# Altium schematic sheet 16ASIC.SchDoc
size A
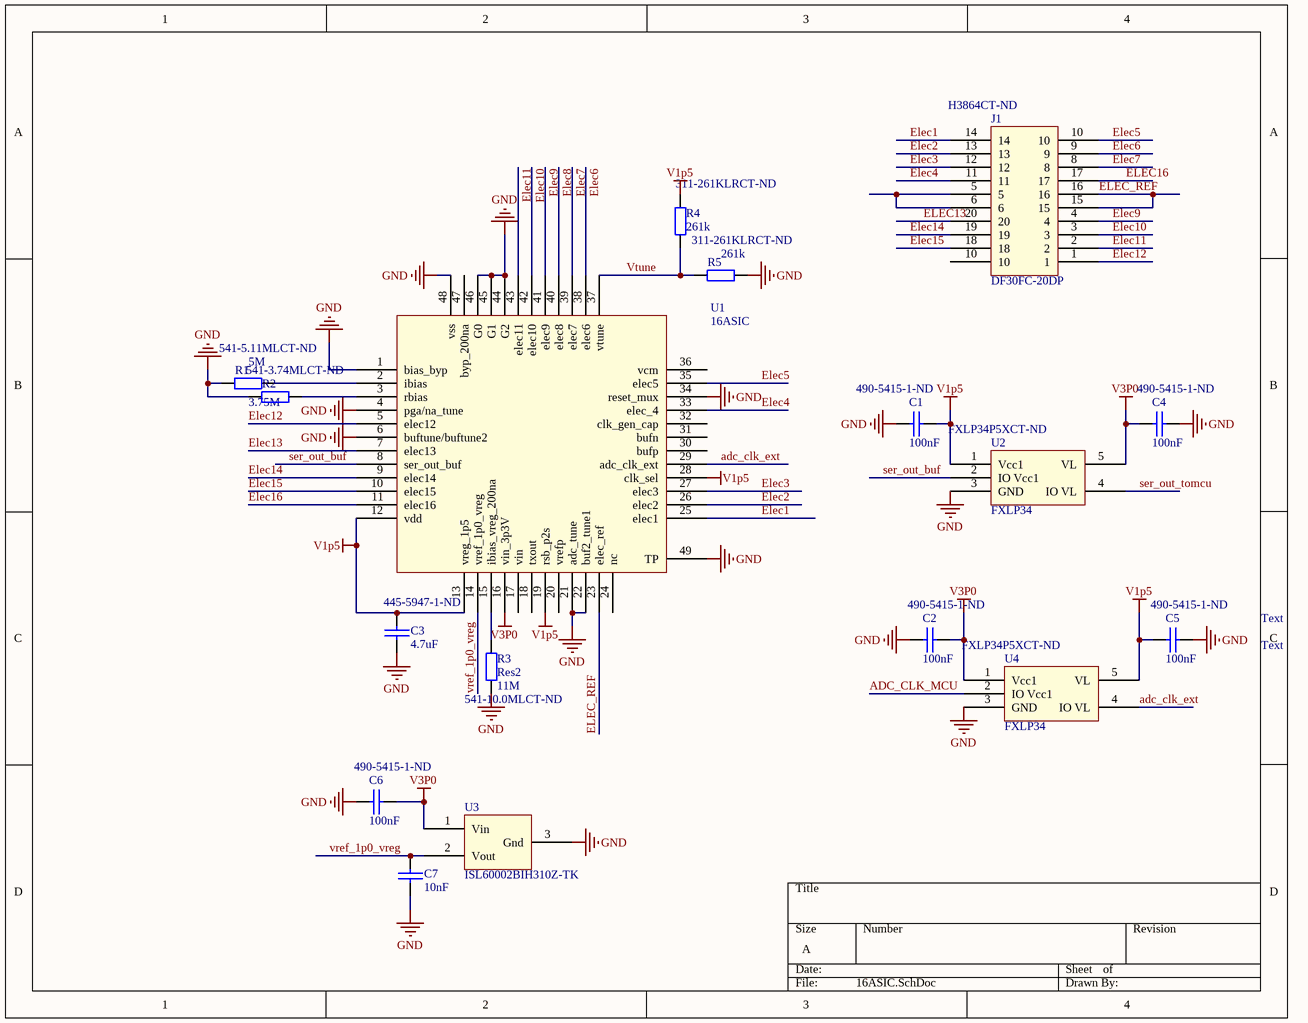
[diagram p0: 16ASIC.SchDoc]

## Parts
C1  value 100nF  Supplier Part Number 1: 490-5415-1-ND  [0402s]  (hidden comment: NP0 50V)
C2  value 100nF  Supplier Part Number 1: 490-5415-1-ND  [0402s]  (hidden comment: NP0 50V)
C3  value 4.7uF  Supplier Part Number 1: 445-5947-1-ND  [0402s]  (hidden comment: NP0 50V)
C4  value 100nF  Supplier Part Number 1: 490-5415-1-ND  [0402s]  (hidden comment: NP0 50V)
C5  value 100nF  Supplier Part Number 1: 490-5415-1-ND  [0402s]  (hidden comment: NP0 50V)
C6  value 100nF  Supplier Part Number 1: 490-5415-1-ND  [0402s]  (hidden comment: NP0 50V)
C7  value 10nF  [0402s]  (hidden comment: NP0 50V)
J1  DF30FC-20DP  Supplier Part Number 1: H3864CT-ND  [DF30FC-20DP]
R1  value 5M  Supplier Part Number 1: 541-5.11MLCT-ND  [0402s]  (hidden comment: Res2)
R2  value 3.75M  Supplier Part Number 1: 541-3.74MLCT-ND  [0402s]  (hidden comment: Res2)
R3  Res2  value 11M  Supplier Part Number 1: 541-10.0MLCT-ND  [0402s]
R4  value 261k  Supplier Part Number 1: 311-261KLRCT-ND  [0402s]  (hidden comment: Res2)
R5  value 261k  Supplier Part Number 1: 311-261KLRCT-ND  [0402s]  (hidden comment: Res2)
U1  16ASIC
U2  FXLP34  Supplier Part Number 1: FXLP34P5XCT-ND  [SOT353-5AN]
U3  ISL60002BIH310Z-TK  [SOT23-3L]
U4  FXLP34  Supplier Part Number 1: FXLP34P5XCT-ND  [SOT353-5AN]

## Nets
GND: C1.1 C2.1 C3.2 C4.2 C5.2 C6.1 C7.1 R1.1 R2.1 R3.1 R5.2 U1.1(bias_byp) U1.4(pga/na_tune) U1.6(buftune/buftune2) U1.21(adc_tune) U1.22(buf2_tune1) U1.34(reset_mux) U1.44(G2) U1.45(G1) U1.46(G0) U1.48(vss) U1.49(TP) U2.3(GND) U3.3(Gnd) U4.3(GND)
V1p5: C1.2 C3.1 C5.1 R4.2 U1.12(vdd) U1.13(vreg_1p5) U1.19(rsb_p2s) U1.28(clk_sel) U2.1(Vcc1) U4.5(VL)
V3P0: C2.2 C4.1 C6.2 U1.16(vin_3p3V) U2.5(VL) U3.1(Vin) U4.1(Vcc1)
adc_clk_ext: U1.29(adc_clk_ext) U4.4(IO_VL)
ADC_CLK_MCU: U4.2(IO_Vcc1)
Elec1: J1.14 U1.25(elec1)
Elec2: J1.13 U1.26(elec2)
Elec3: J1.12 U1.27(elec3)
Elec4: J1.11 U1.33(elec_4)
Elec5: J1.10 U1.35(elec5)
Elec6: J1.9 U1.38(elec6)
Elec7: J1.8 U1.39(elec7)
Elec8: U1.40(elec8)
Elec9: J1.4 U1.41(elec9)
Elec10: J1.3 U1.42(elec10)
Elec11: J1.2 U1.43(elec11)
Elec12: J1.1 U1.5(elec12)
Elec13: J1.20 U1.7(elec13)
Elec14: J1.19 U1.9(elec14)
Elec15: J1.18 U1.10(elec15)
Elec16: J1.17 U1.11(elec16)
ELEC_REF: J1.15 J1.16 U1.23(elec_ref)
ser_out_buf: U1.8(ser_out_buf) U2.2(IO_Vcc1)
ser_out_tomcu: U2.4(IO_VL)
vref_1p0_vreg: C7.2 U1.14(vref_1p0_vreg) U3.2(Vout)
Vtune: R4.1 R5.1 U1.37(vtune)
NetJ1_5: J1.5 J1.6
NetR1_2: R1.2 U1.2(ibias)
NetR2_2: R2.2 U1.3(rbias)
NetR3_2: R3.2 U1.15(ibias_vreg_200na)

Not connected (* = marked no-connect by the designer): U1 17(vin) 18(txout) 20(vrefp) 24(nc) 30(bufp) 31(bufn) 32(clk_gen_cap) 36(vcm) 47(byp_200na)

## Notes on the sheet
- Text

## Library data of the parts
C1 C2 C4-C6 = Cap: Capacitor; Part Field 1: 0402; Manufacturer: Murata Electronics North America; Manufacturer Part Number: GRM155R61C104KA88D; Description: CAP CER .1UF 16V X5R 0402; Capacitance: 0.1µF; Voltage - Rated: 16V; Tolerance: ±10%; Temperature Coefficient: X5R; Supplier 1: Digi-Key; RoHS: RoHS Compliant; Category: Capacitors; Stock 1: 1934090; Pricing 1: 1=0.06, 10=0.038, 50=0.0182, 100=0.0136, 250=0.0098, 500=0.00724, 1000=0.00491 (USD); Mounting Type: Surface Mount, MLCC; Operating Temperature: -55°C ~ 85°C; Applications: General Purpose; Ratings: -; Package / Case: 0402 (1005 Metric); Size / Dimension: 0.039" L x 0.020" W (1.00mm x 0.50mm); Height: -; Thickness: 0.022" (0.55mm); Lead Spacing: -; Features: -; Packaging: Cut Tape (CT); Lead Style: -; ComponentLink1URL: http://search.murata.co.jp/Ceramy/image/img/PDF/ENG/GRM155R61C104KA88.pdf; ComponentLink1Description: http://search.murata.co.jp/Ceramy/image/img/PDF/ENG/GRM155R61C104KA88.pdf
C3 = Cap: Capacitor; Part Field 1: 0402; Manufacturer: TDK Corporation; Manufacturer Part Number: C1005X5R0J475K; Description: CAP CER 4.7UF 6.3V X5R 10% 0402; Capacitance: 4.7µF; Voltage - Rated: 6.3V; Tolerance: ±10%; Temperature Coefficient: X5R; Supplier 1: Digi-Key; RoHS: RoHS Compliant; Category: Capacitors; Stock 1: 168120; Pricing 1: 1=0.53, 10=0.415, 100=0.25, 250=0.18752, 500=0.16, 1000=0.125 (USD); Mounting Type: Surface Mount, MLCC; Operating Temperature: -55°C ~ 85°C; Applications: General Purpose; Ratings: -; Package / Case: 0402 (1005 Metric); Size / Dimension: 0.039" L x 0.020" W (1.00mm x 0.50mm); Height: -; Thickness: 0.022" (0.55mm); Lead Spacing: -; Features: -; Packaging: Cut Tape (CT); Lead Style: -; ComponentLink1URL: http://www.tdk.co.jp/tefe02/e412_c.pdf; ComponentLink1Description: http://www.tdk.co.jp/tefe02/e412_c.pdf
C7 = Cap: Capacitor; Part Field 1: 0402
J1 = DF30FC-20DP: Manufacturer: Hirose Electric Co Ltd; Manufacturer Part Number: DF30FC-20DP-0.4V(82); Description: CONN PLUG 20POS 0.4MM SMD GOLD; Connector Type: Header, Center Strip Contacts; Number of Positions: 20; Pitch: 0.016" (0.40mm); Mated Stacking Heights: 0.9mm; Supplier 1: Digi-Key; RoHS: RoHS Compliant; Category: Connectors, Interconnects; Stock 1: 11216; Pricing 1: 1=1.75, 10=1.426, 25=1.2652, 100=1.035, 250=0.874 (USD); Number of Rows: 2; Mounting Type: Surface Mount; Features: -; Contact Finish: Gold; Contact Finish Thickness: -; Packaging: Cut Tape (CT); Height Above Board: 0.031" (0.80mm); ComponentLink1URL: http://www.hirose.co.jp/cataloge_hp/e68410340.pdf; ComponentLink1Description: http://www.hirose.co.jp/cataloge_hp/e68410340.pdf
R1 = Res2: Resistor; Manufacturer: Vishay/Dale; Manufacturer Part Number: CRCW04025M11FKED; Description: RES 5.11M OHM 1/16W 1% 0402 SMD; Resistance (Ohms): 5.11M; Power (Watts): 0.063W, 1/16W; Temperature Coefficient: ±100ppm/°C; Tolerance: ±1%; Published: 8-Jun-2000; LatestRevisionDate: 17-Jul-2002; LatestRevisionNote: Re-released for DXP Platform.; PackageReference: AXIAL-0.4; Publisher: Altium Limited; PackageDescription: Axial Device, Thru-Hole; 2 Leads; 0.4 in Pin Spacing; Supplier 1: Digi-Key; RoHS: RoHS Compliant; Category: Resistors; Stock 1: 98650; Pricing 1: 10=0.083, 50=0.0444, 200=0.0255, 1000=0.0174 (USD); Composition: Thick Film; Features: -; Size / Dimension: 0.039" L x 0.020" W (1.00mm x 0.50mm); Height: 0.014" (0.35mm); Number of Terminations: 2; Packaging: Cut Tape (CT); Package / Case: 0402 (1005 Metric); ComponentLink1URL: http://www.vishay.com/doc?20035; ComponentLink1Description: http://www.vishay.com/doc?20035
R2 = Res2: Resistor; Manufacturer: Vishay/Dale; Manufacturer Part Number: CRCW04023M74FKED; Description: RES 3.74M OHM 1/16W 1% 0402 SMD; Resistance (Ohms): 3.74M; Power (Watts): 0.063W, 1/16W; Temperature Coefficient: ±100ppm/°C; Tolerance: ±1%; Published: 8-Jun-2000; LatestRevisionDate: 17-Jul-2002; LatestRevisionNote: Re-released for DXP Platform.; PackageReference: AXIAL-0.4; Publisher: Altium Limited; PackageDescription: Axial Device, Thru-Hole; 2 Leads; 0.4 in Pin Spacing; Supplier 1: Digi-Key; RoHS: RoHS Compliant; Category: Resistors; Stock 1: 25816; Pricing 1: 10=0.083, 50=0.0444, 200=0.0255, 1000=0.0174 (USD); Composition: Thick Film; Features: -; Size / Dimension: 0.039" L x 0.020" W (1.00mm x 0.50mm); Height: 0.014" (0.35mm); Number of Terminations: 2; Packaging: Cut Tape (CT); Package / Case: 0402 (1005 Metric); ComponentLink1URL: http://www.vishay.com/doc?20035; ComponentLink1Description: http://www.vishay.com/doc?20035
R3 = Res2: Resistor; Manufacturer: Vishay/Dale; Manufacturer Part Number: CRCW040210M0FKED; Description: RES 10.0M OHM 1/16W 1% 0402 SMD; Resistance (Ohms): 10M; Power (Watts): 0.063W, 1/16W; Temperature Coefficient: ±100ppm/°C; Tolerance: ±1%; Published: 8-Jun-2000; LatestRevisionDate: 17-Jul-2002; LatestRevisionNote: Re-released for DXP Platform.; PackageReference: AXIAL-0.4; Publisher: Altium Limited; PackageDescription: Axial Device, Thru-Hole; 2 Leads; 0.4 in Pin Spacing; Supplier 1: Digi-Key; RoHS: RoHS Compliant; Category: Resistors; Stock 1: 220964; Pricing 1: 10=0.083, 50=0.0444, 200=0.0255, 1000=0.0174 (USD); Composition: Thick Film; Features: -; Size / Dimension: 0.039" L x 0.020" W (1.00mm x 0.50mm); Height: 0.014" (0.35mm); Number of Terminations: 2; Packaging: Cut Tape (CT); Package / Case: 0402 (1005 Metric); ComponentLink1URL: http://www.vishay.com/doc?20035; ComponentLink1Description: http://www.vishay.com/doc?20035
R4 R5 = Res2: Resistor; Manufacturer: Yageo; Manufacturer Part Number: RC0402FR-07261KL; Description: RES 261K OHM 1/16W 1% 0402 SMD; Power (Watts): 0.063W, 1/16W; Temperature Coefficient: ±100ppm/°C; Tolerance: ±1%; Published: 8-Jun-2000; LatestRevisionDate: 17-Jul-2002; LatestRevisionNote: Re-released for DXP Platform.; PackageReference: AXIAL-0.4; Publisher: Altium Limited; PackageDescription: Axial Device, Thru-Hole; 2 Leads; 0.4 in Pin Spacing; Supplier 1: Digi-Key; RoHS: RoHS Compliant; Category: Resistors; Stock 1: 26620; Pricing 1: 10=0.014, 50=0.0104, 100=0.0079, 250=0.00584, 500=0.00432, 1000=0.00288 (USD); Resistance (Ohms): 261K; Composition: Thick Film; Features: -; Size / Dimension: 0.039" L x 0.020" W (1.00mm x 0.50mm); Height: 0.014" (0.35mm); Number of Terminations: 2; Packaging: Cut Tape (CT); Package / Case: 0402 (1005 Metric); ComponentLink1URL: http://www.yageo.com/documents/recent/PYu-RC0402_51_RoHS_L_6.pdf; ComponentLink1Description: http://www.yageo.com/documents/recent/PYu-RC0402_51_RoHS_L_6.pdf
U2 U4 = FXLP34: Manufacturer: Fairchild Semiconductor; Manufacturer Part Number: FXLP34P5X; Description: TRANSLATOR 1BIT UNIDIRECT SC70-5; Logic Function: Translator, Unidirectional; Number of Bits: 1; Input Type: Voltage; Differential - Input:Output: No/No; Propagation Delay (Max): 3ns; Voltage - Supply: 1 V ~ 3.6 V; Supplier 1: Digi-Key; RoHS: RoHS Compliant; Category: Integrated Circuits (ICs); Stock 1: 73920; Pricing 1: 1=0.77, 25=0.5916, 100=0.522, 250=0.4524, 500=0.3828, 750=0.3306, 1000=0.3045, 2000=0.2784 (USD); Output Type: Voltage; Data Rate: -; Number of Channels: 1; Number of Outputs/Channel: 1; Operating Temperature: -40°C ~ 85°C; Package / Case: 6-TSSOP (5 lead), SC-88A, SOT-353; Supplier Device Package: SC-70-5; Packaging: Cut Tape (CT); ComponentLink1URL: http://www.fairchildsemi.com/ds/FX/FXLP34.pdf; ComponentLink1Description: http://www.fairchildsemi.com/ds/FX/FXLP34.pdf
U3 = ISL60002BIH310Z-TK: IC VOLT REF FGA LV 1.024V SOT-23; Manufacturer: Intersil; Reference Type: Series, Precision; Tolerance: ±1mV; Temperature Coefficient: 20ppm/°C; Voltage - Input: 2.7 V ~ 5.5 V; Number of Channels: 1; Current - Quiescent: 900nA; Current - Output: 7mA; Supplier 1: Digi-Key; Manufacturer Part Number: ISL60002BIH310Z-TK; RoHS: RoHS Compliant; Category: Integrated Circuits (ICs); Stock 1: 3269; Pricing 1: 1=5.99, 25=4.86, 100=4.13 (USD); Voltage - Output: 1.024V; Current - Cathode: -; Operating Temperature: -40°C ~ 85°C; Mounting Type: Surface Mount; Package / Case: TO-236-3, SC-59, SOT-23-3; Supplier Device Package: SOT-23-3; Packaging: Cut Tape (CT); ComponentLink1URL: http://www.intersil.com/data/fn/fn8082.pdf; ComponentLink1Description: http://www.intersil.com/data/fn/fn8082.pdf